# EAGLE design LDS5362BS_breakout (EAGLE 7.1.0)
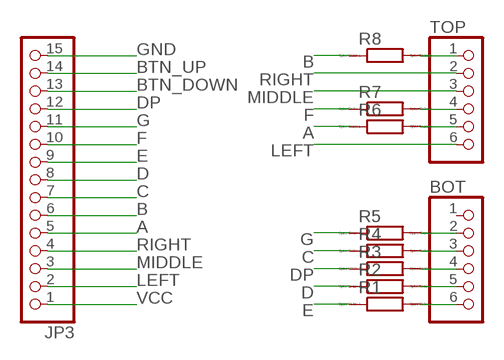
[diagram p0: schematic, sheet 1]

## Parts
BOT  PINHD-1X6  [1X06]
JP3  PINHD-1X15  [1X15]
R1  R-EU_R1206  [R1206]
R2  R-EU_R1206  [R1206]
R3  R-EU_R1206  [R1206]
R4  R-EU_R1206  [R1206]
R5  R-EU_R1206  [R1206]
R6  R-EU_R1206  [R1206]
R7  R-EU_R1206  [R1206]
R8  R-EU_R1206  [R1206]
TOP  PINHD-1X6  [1X06]

## Nets
A: JP3.5 R6.1
B: JP3.6 R8.1
BTN_DOWN: JP3.13
BTN_UP: JP3.14
C: JP3.7 R4.1
D: JP3.8 R2.1
DP: JP3.12 R3.1
E: JP3.9 R1.1
F: JP3.10 R7.1
G: JP3.11 R5.1
GND: JP3.15
LEFT: JP3.2 TOP.6
MIDDLE: JP3.3 TOP.3
N$1: R8.2 TOP.1
N$2: R7.2 TOP.4
N$3: R6.2 TOP.5
N$4: BOT.2 R5.2
N$5: BOT.3 R4.2
N$6: BOT.4 R3.2
N$7: BOT.5 R2.2
N$8: BOT.6 R1.2
RIGHT: JP3.4 TOP.2
VCC: JP3.1
Unconnected: BOT.1

## Library data of the parts
BOT TOP = pinhead:PINHD-1X6: PIN HEADER
JP3 = pinhead:PINHD-1X15: PIN HEADER
R1-R8 = resistor:R-EU_: RESISTOR, European symbol; SPICEPREFIX: R

## Board
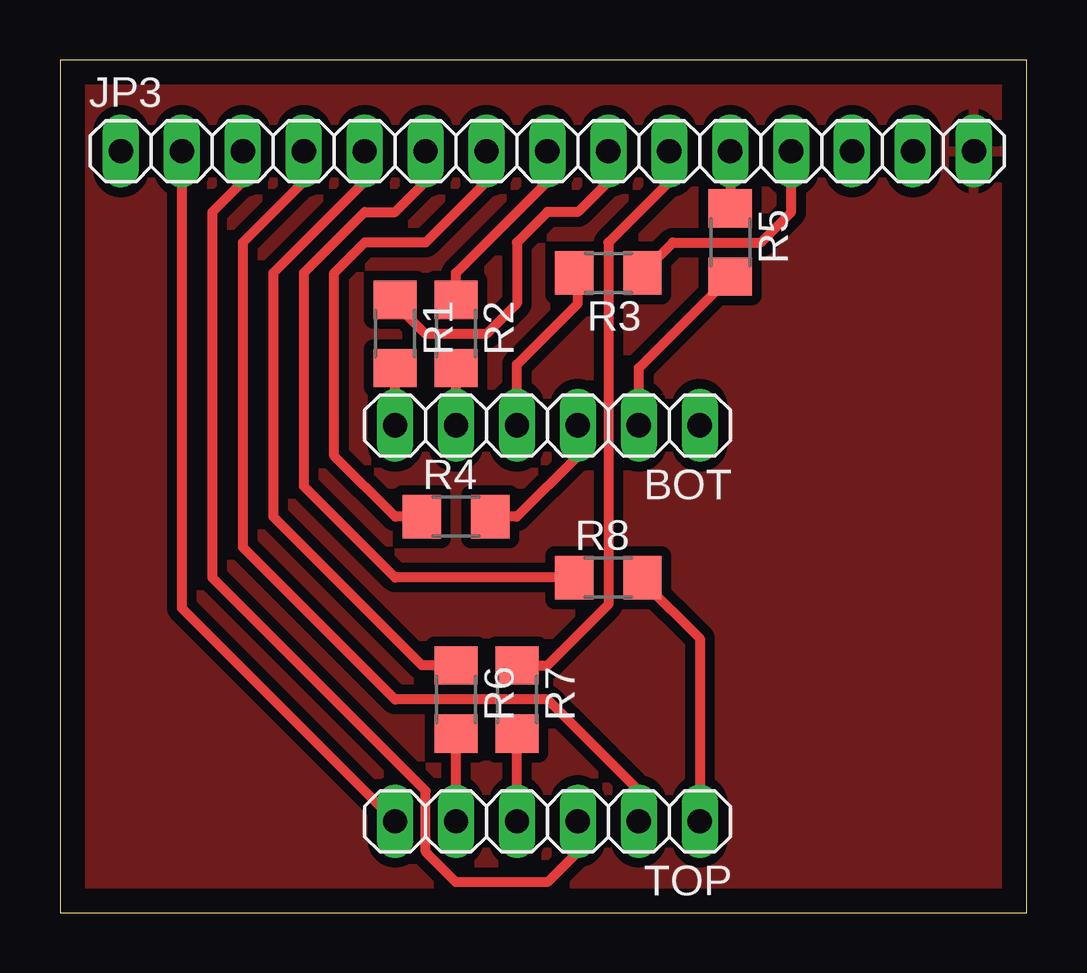
[diagram p1: board, top side]

Size 40.31 x 35.55 mm. Coordinates in mm from the lower left corner, seen from the top.
Outline: 0,0 40.31,0 40.31,35.55 0,35.55 0,0
Copper layers (1*16): Top 0.035mm / dielectric 1.5mm / Bottom 0.035mm
Design rules "default": minimum track width 10mil, minimum drill 24mil, track to track 8mil, track to pad 8mil, pad to pad 8mil, via to via 8mil, smd to smd 8mil, copper to edge 40mil, drill to drill 8mil, minimum pad ring 10mil, minimum via ring 8mil, stop-mask expansion 4mil, vias tented up to drill 0mil, thermal gap 10mil

### Footprints (pad centres in the part's own frame; a part is rotated, then mirrored left to right if it is on the bottom)
1X06 = drill 1.016 long: 1 -6.35,0; 2 -3.81,0; 3 -1.27,0; 4 1.27,0; 5 3.81,0; 6 6.35,0
1X15 = drill 1.016 long: 1 -17.78,0; 2 -15.24,0; 3 -12.7,0; 4 -10.16,0; 5 -7.62,0; 6 -5.08,0; 7 -2.54,0; 8 0,0; 9 2.54,0; 10 5.08,0; 11 7.62,0; 12 10.16,0; 13 12.7,0; 14 15.24,0; 15 17.78,0
R1206 = smd 1.6 x 1.803: 1 -1.422,0; 2 1.422,0

### Placement (x,y rotation side)
BOT  20.32,20.32 180 top
JP3  20.32,31.75 0 top
R1  13.97,24.13 270 top
R2  16.51,24.13 270 top
R3  22.86,26.67 180 top
R4  16.51,16.51 0 top
R5  27.94,27.94 270 top
R6  16.51,8.89 270 top
R7  19.05,8.89 270 top
R8  22.86,13.97 0 top
TOP  20.32,3.81 180 top

### Tracks (layer width: path | path; a pad name or v marks a point on that pad's centre or on a via)
A
  Top 0.406: JP3.5 12.7,30.48 8.89,26.67 8.89,16.51 15.09,10.31 R6.1
B
  Top 0.406: JP3.6 15.24,30.48 13.97,29.21 12.7,29.21 10.16,26.67 10.16,17.78 13.97,13.97 R8.1
C
  Top 0.406: JP3.7 17.78,30.48 15.24,27.94 12.7,27.94 11.43,26.67 11.43,19.05 13.97,16.51 R4.1
D
  Top 0.406: JP3.8 20.32,30.48 16.51,26.67 R2.1
DP
  Top 0.406: JP3.12 30.48,29.21 29.21,27.94 25.55,27.94 R3.1
E
  Top 0.406: JP3.9 22.86,30.48 21.59,29.21 20.32,29.21 19.05,27.94 19.05,25.4 17.78,24.13 15.24,24.13 13.97,25.4 R1.1
F
  Top 0.406: JP3.10 25.4,30.48 22.86,27.94 22.86,12.85 20.32,10.31 R7.1
G
  Top 0.406: JP3.11 R5.1
GND
  pour Top (isolate 0.406): 0,35.56 40.64,35.56 40.64,0 0,0
LEFT
  Top 0.406: JP3.2 5.08,12.7 TOP.6
MIDDLE
  Top 0.406: JP3.3 7.62,30.48 6.35,29.21 6.35,13.97 15.24,5.08 15.24,2.54 16.51,1.27 20.32,1.27 21.59,2.54 TOP.3
N$1
  Top 0.406: 26.67,5.08 TOP.1 26.67,11.43 24.28,13.82 R8.2
N$2
  Top 0.406: TOP.4 R7.2
N$3
  Top 0.406: TOP.5 R6.2
N$4
  Top 0.406: BOT.2 24.13,22.71 R5.2
N$5
  Top 0.406: BOT.3 21.59,19.05 19.05,16.51 R4.2
N$6
  Top 0.406: BOT.4 19.05,22.86 21.59,25.4 21.59,26.52 R3.2
N$7
  Top 0.406: BOT.5 R2.2
N$8
  Top 0.406: BOT.6 R1.2
RIGHT
  Top 0.406: JP3.4 10.16,30.48 7.62,27.94 7.62,15.24 13.97,8.89 20.32,8.89 24.13,5.08 TOP.2